# EasyEDA schematic OP3_BUTTON_EasyEDA.json
TITLE: Sheet_1; REV: 1.0; Date: 2022-10-05; Sheet: 1/1; Drawn By: bimaaa; Company: ROBOTIIK FILKOM UB
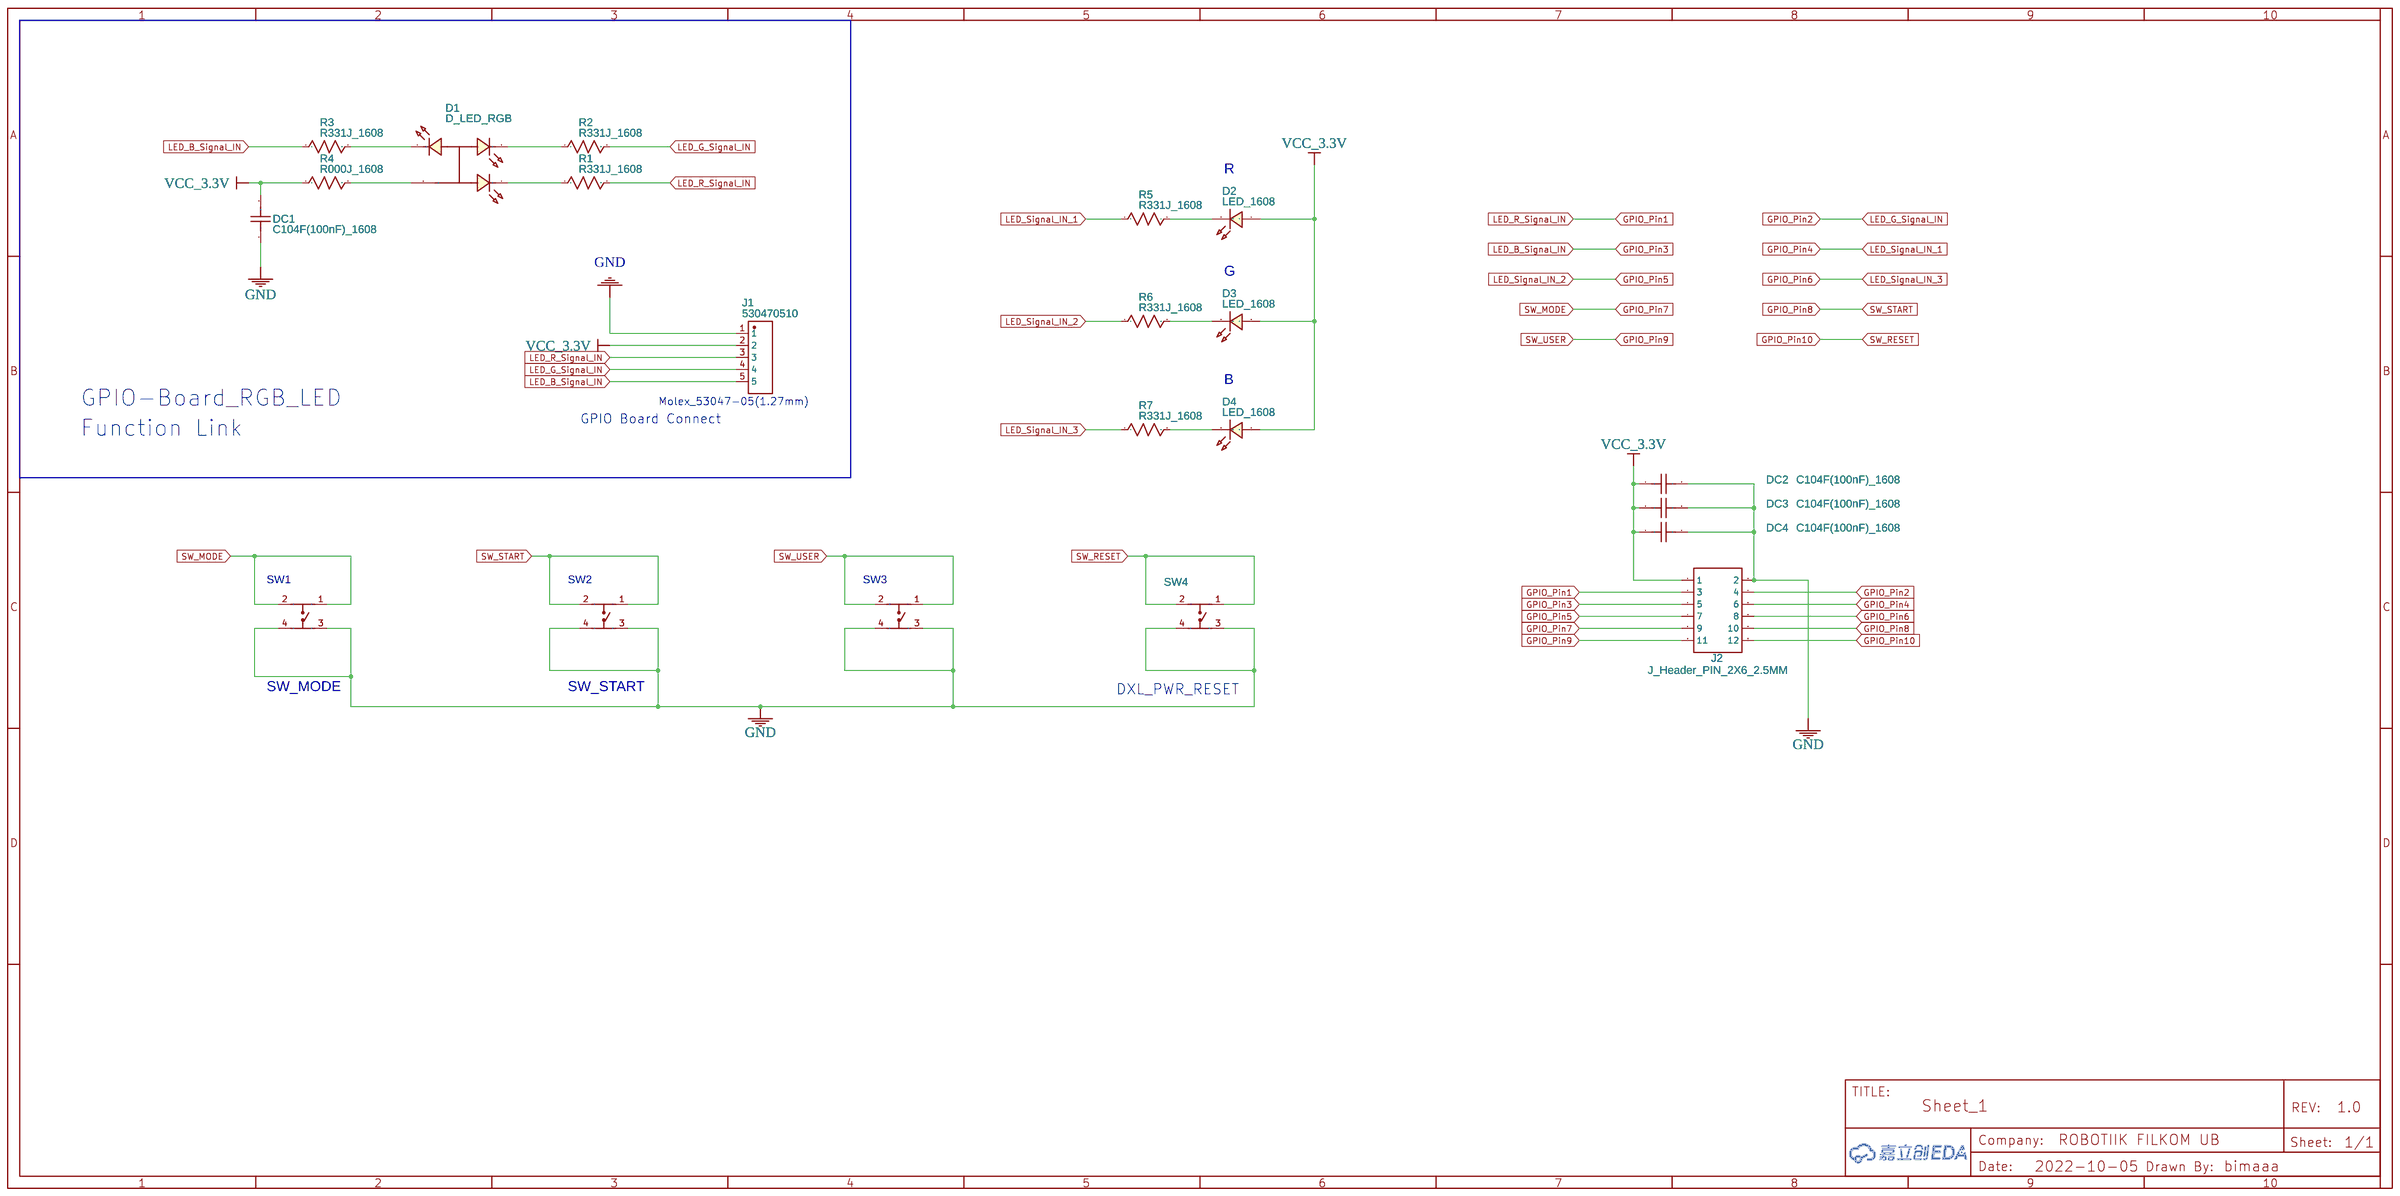
[diagram p0: schematic sheet]

## Parts
D1  D_LED_RGB  [LED-SMD_YXD-1204RGB-C]
D2  LED_1608  [LED0603_RED]
D3  LED_1608  [LED0603_RED]
D4  LED_1608  [LED0603_RED]
DC1  C104F(100nF)_1608  [C0603]
DC2  C104F(100nF)_1608  [C0603]
DC3  C104F(100nF)_1608  [C0603]
DC4  C104F(100nF)_1608  [C0603]
J1  530470510  [CONN-TH_530470510]
J2  J_Header_PIN_2X6_2.5MM  [HDR-TH_12P-P2.54-V-M-R2-C6-S2.54]
R1  R331J_1608  [R0603]
R2  R331J_1608  [R0603]
R3  R331J_1608  [R0603]
R4  R000J_1608  [R0603]
R5  R331J_1608  [R0603]
R6  R331J_1608  [R0603]
R7  R331J_1608  [R0603]
SW3  SMD Tactile Switch6*6*6mm  [SW-SMD_4P-L6.0-W6.0-P4.50-LS9.0_C23873]
SW4  SMD Tactile Switch6*6*6mm  [SW-SMD_4P-L6.0-W6.0-P4.50-LS9.0_C23873]
SW5  SMD Tactile Switch6*6*6mm  [SW-SMD_4P-L6.0-W6.0-P4.50-LS9.0_C23873]
SW6  SMD Tactile Switch6*6*6mm  [SW-SMD_4P-L6.0-W6.0-P4.50-LS9.0_C23873]

## Library data of the parts
D1 = YXD-1204RGB-C: Supplier: LCSC; Supplier Part: C9900001072; Manufacturer: null; JLCPCB Part Class: Extended Part; Contributor: LCSC
D2-D4 = LED-0603_R: Manufacturer: EVERLIGHT(台湾亿光); Manufacturer Part: 19-217/R6C-AL1M2VY/3T; Supplier Part: C72044; Supplier: LCSC; Contributor: LCEDA_01
DC1-DC4 = C_0603_US: Contributor: LCEDA_Lib
J1 = 530470510: Supplier: LCSC; Supplier Part: C471412; Manufacturer: MOLEX; Contributor: LCSC; JLCPCB Part Class: Extended Part
J2 = Header-Male-2.54_2x6: Supplier: LCSC; Supplier Part: C66689
R1-R7 = R_0603_US: Contributor: LCEDA_Lib
SW3-SW6 = SMD Tactile Switch6*6*6mm: Supplier Part: C23873; Supplier: LCSC; Manufacturer: null; JLCPCB Part Class: Extended Part

## Nets
GND: DC1.1 DC2.2 DC3.2 DC4.2 J1.1 J2.2 SW3.3 SW3.4 SW4.3 SW4.4 SW5.3 SW5.4 SW6.3 SW6.4
VCC_3.3V: D2.1 D3.1 D4.1 DC1.2 DC2.1 DC3.1 DC4.1 J1.2 J2.1 R4.1
GPIO_Pin1: J1.3 J2.3 R1.2
GPIO_Pin2: J1.4 J2.4 R2.2
GPIO_Pin3: J1.5 J2.5 R3.1
GPIO_Pin4: J2.6 R5.1
GPIO_Pin5: J2.7 R6.1
GPIO_Pin6: J2.8 R7.1
GPIO_Pin7: J2.9 SW3.1 SW3.2
GPIO_Pin8: J2.10 SW5.1 SW5.2
GPIO_Pin9: J2.11 SW6.1 SW6.2
GPIO_Pin10: J2.12 SW4.1 SW4.2
Net-(D1-1): D1.1(K) R3.2
Net-(D1-2): D1.2(K) R2.1
Net-(D1-3): D1.3 R4.2
Net-(D1-4): D1.4(K) R1.1
Net-(D2-2): D2.2 R5.2
Net-(D3-2): D3.2 R6.2
Net-(D4-2): D4.2 R7.2

## Notes on the sheet
- R
- G
- B
- GPIO-Board_RGB_LED
- Molex_53047-05(1.27mm)
- Function Link
- GPIO Board Connect
- SW1
- SW2
- SW3
- SW_MODE
- SW_START
- DXL_PWR_RESET
